# Altium schematic sheet tie-il12-il07.SchDoc: Copper Suicide - Net Tie 12:07
size Letter; CheckedBy: J. Brinton; CompanyName: Signal Laboratories, Inc.; DrawnBy: J. Brinton; Engineer: J. Brinton; Address1: 3479 Edison Way; Address2: Menlo Park CA 94025; Address3: +1 (877) 778-8435; Address4: siglabs.com; Revision: 3; SheetNumber: 25; SheetTotal: 47
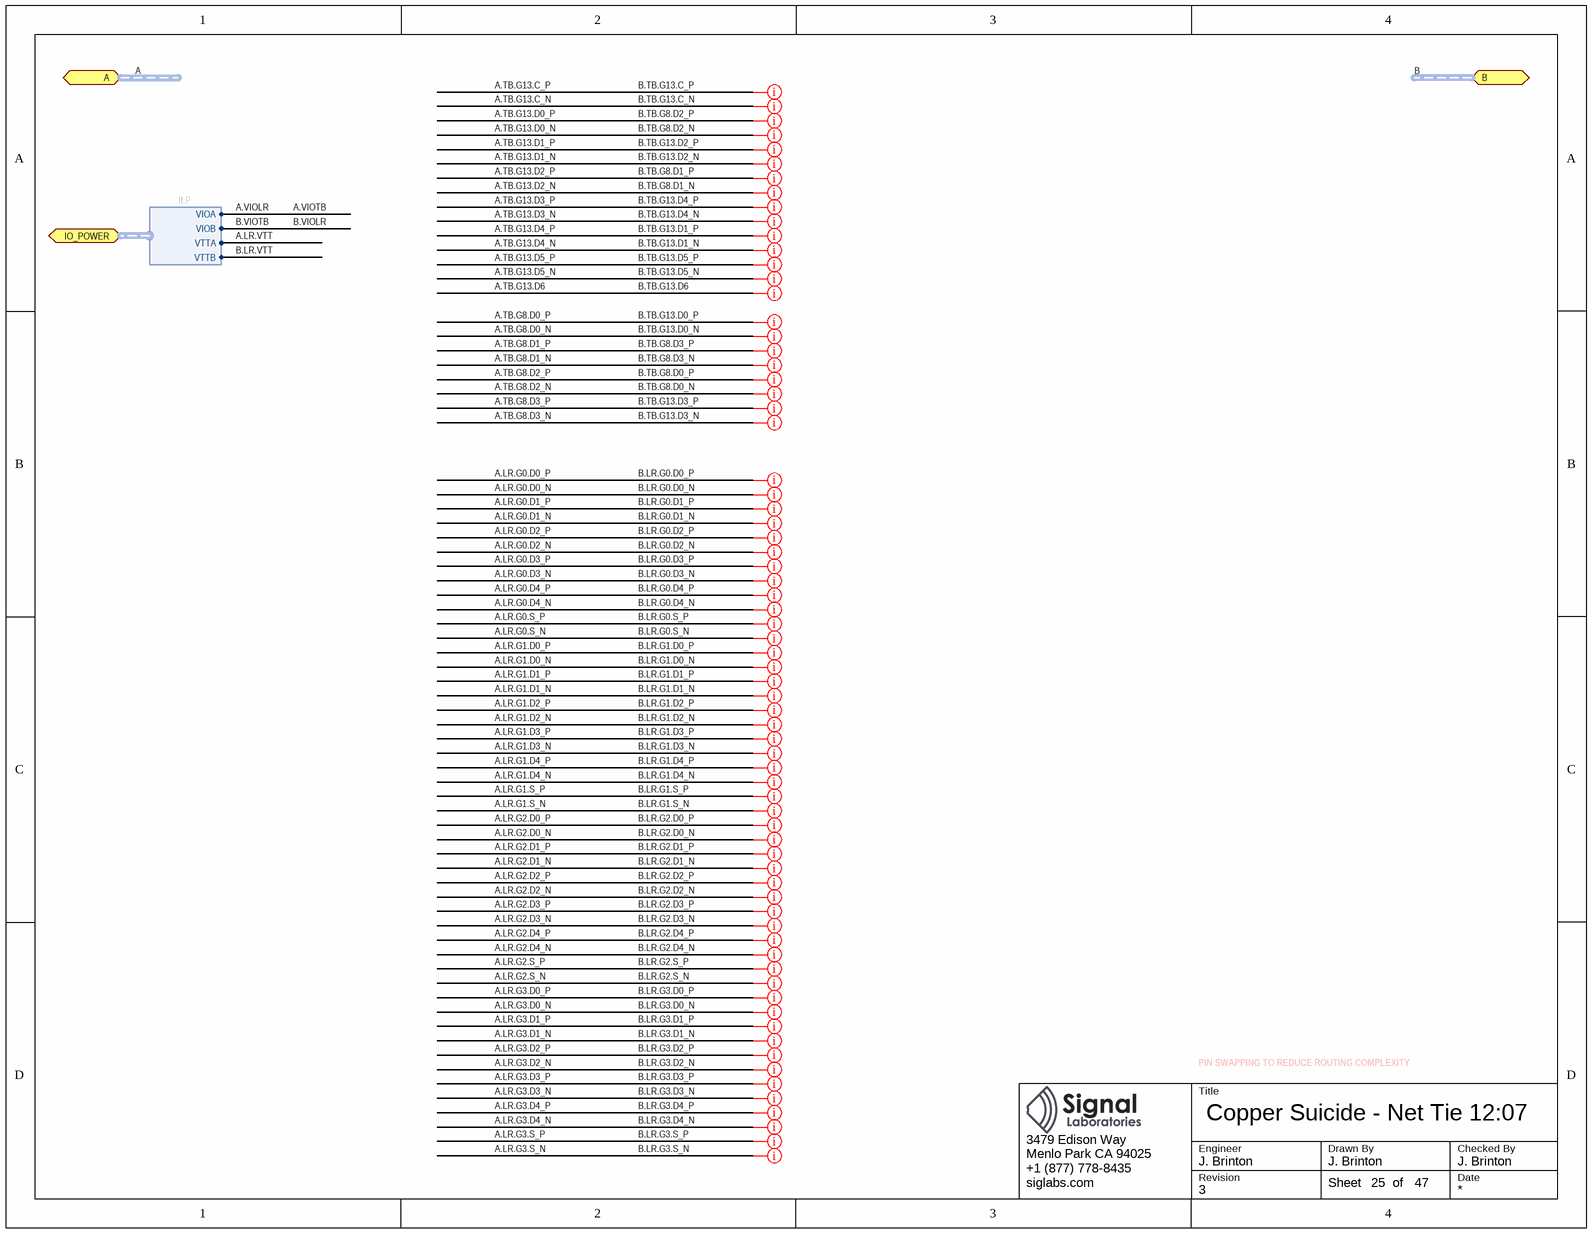
[diagram p0: tie-il12-il07.SchDoc]

## Ports
A (harness IL), B (harness IL), IO_POWER (harness ILP)

## Harnesses
ILP: VIOA, VIOB, VTTA, VTTB

## Nets
A.LR.VTT: port IO_POWER.VTTA
A.VIOLR: port IO_POWER.VIOA  [also labelled A.VIOTB]
B.LR.VTT: port IO_POWER.VTTB
B.VIOLR: port IO_POWER.VIOB  [also labelled B.VIOTB]

## Buses and harness runs
harness A = port A
harness B = port B

## Layout directives
net class z50: A.TB.G13.D6
net class z50; differential pair; net class loose: A.LR.G0.D0_N, A.LR.G0.D0_P, A.LR.G0.D1_N, A.LR.G0.D1_P, A.LR.G0.D2_N, A.LR.G0.D2_P, A.LR.G0.D3_N, A.LR.G0.D3_P, A.LR.G0.D4_N, A.LR.G0.D4_P, A.LR.G0.S_N, A.LR.G0.S_P, A.LR.G1.D0_N, A.LR.G1.D0_P, A.LR.G1.D1_N, A.LR.G1.D1_P, A.LR.G1.D2_N, A.LR.G1.D2_P, A.LR.G1.D3_N, A.LR.G1.D3_P, A.LR.G1.D4_N, A.LR.G1.D4_P, A.LR.G1.S_N, A.LR.G1.S_P, A.LR.G2.D0_N, A.LR.G2.D0_P, A.LR.G2.D1_N, A.LR.G2.D1_P, A.LR.G2.D2_N, A.LR.G2.D2_P, A.LR.G2.D3_N, A.LR.G2.D3_P, A.LR.G2.D4_N, A.LR.G2.D4_P, A.LR.G2.S_N, A.LR.G2.S_P, A.LR.G3.D0_N, A.LR.G3.D0_P, A.LR.G3.D1_N, A.LR.G3.D1_P, A.LR.G3.D2_N, A.LR.G3.D2_P, A.LR.G3.D3_N, A.LR.G3.D3_P, A.LR.G3.D4_N, A.LR.G3.D4_P, A.LR.G3.S_N, A.LR.G3.S_P, A.TB.G8.D0_N, A.TB.G8.D0_P, A.TB.G8.D1_N, A.TB.G8.D1_P, A.TB.G8.D2_N, A.TB.G8.D2_P, A.TB.G8.D3_N, A.TB.G8.D3_P, A.TB.G13.C_N, A.TB.G13.C_P, A.TB.G13.D0_N, A.TB.G13.D0_P, A.TB.G13.D1_N, A.TB.G13.D1_P, A.TB.G13.D2_N, A.TB.G13.D2_P, A.TB.G13.D3_N, A.TB.G13.D3_P, A.TB.G13.D4_N, A.TB.G13.D4_P, A.TB.G13.D5_N, A.TB.G13.D5_P

## Notes on the sheet
- PIN SWAPPING TO REDUCE ROUTING COMPLEXITY
- Title
- Engineer
- Revision
- Drawn By
- Checked By
- Date
- Sheet
- of